# EAGLE design mainboard-raspi-2 (EAGLE 6.4)
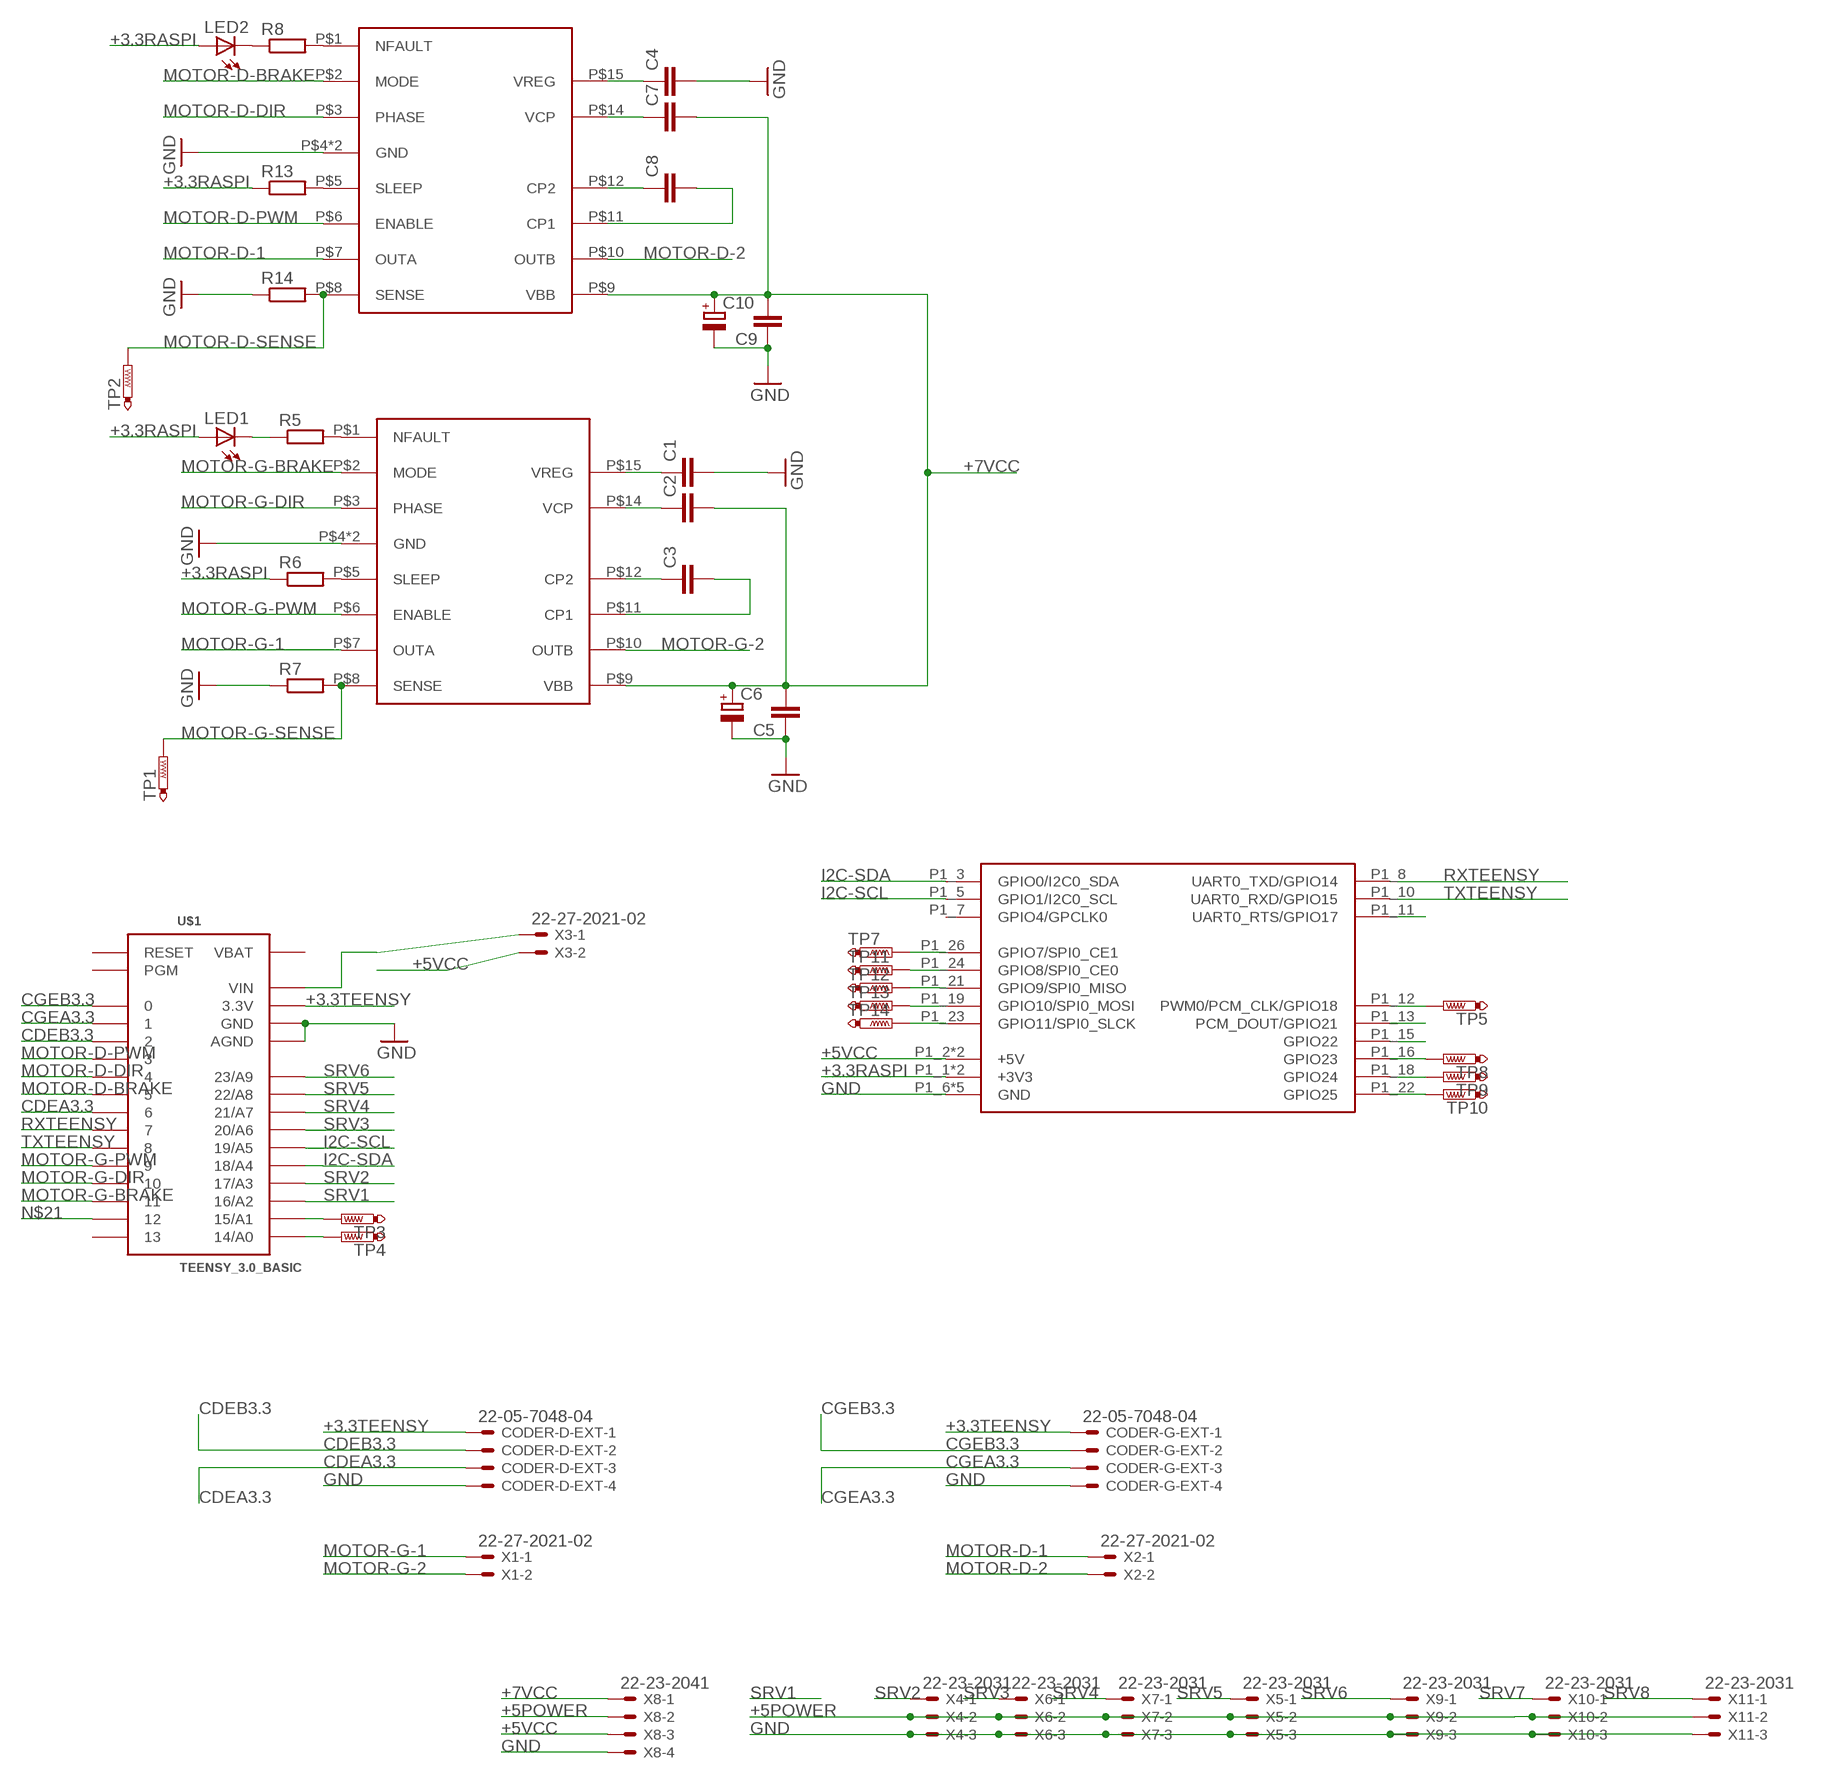
[diagram p0: schematic, sheet 1]

## Parts
C1  C-EUC0805K  [C0805K]
C2  C-EUC0805K  [C0805K]
C3  C-EUC0805K  [C0805K]
C4  C-EUC0805K  [C0805K]
C5  C-EUC0805K  [C0805K]
C6  CPOL-EUE3.5-8  [E3,5-8]
C7  C-EUC0805K  [C0805K]
C8  C-EUC0805K  [C0805K]
C9  C-EUC0805K  [C0805K]
C10  CPOL-EUE3.5-8  [E3,5-8]
CODER-D-EXT  22-05-7048-04  [7395-04]
CODER-G-EXT  22-05-7048-04  [7395-04]
LED1  LED3MM  [LED3MM]
LED2  LED3MM  [LED3MM]
R5  R-EU_R0805W  [R0805W]
R6  R-EU_0204/7  [0204/7]
R7  R-EU_R0805W  [R0805W]
R8  R-EU_R0805W  [R0805W]
R13  R-EU_0204/7  [0204/7]
R14  R-EU_R0805W  [R0805W]
TP1  PTR1PAD1-13  [P1-13]
TP2  PTR1PAD1-13  [P1-13]
TP3  PTR1PAD1-13  [P1-13]
TP4  PTR1PAD1-13  [P1-13]
TP5  PTR1PAD1-13  [P1-13]
TP7  PTR1PAD1-13  [P1-13]
TP8  PTR1PAD1-13  [P1-13]
TP9  PTR1PAD1-13  [P1-13]
TP10  PTR1PAD1-13  [P1-13]
TP11  PTR1PAD1-13  [P1-13]
TP12  PTR1PAD1-13  [P1-13]
TP13  PTR1PAD1-13  [P1-13]
TP14  PTR1PAD1-13  [P1-13]
U$1  TEENSY_3.0_BASIC  [TEENSY_3.0_BASIC]
U$3  A3950-DIL  [DIL16]
U$4  A3950-DIL  [DIL16]
U$5  RPI-B-V1SHIELD  [RPI-B-V1-SHIELD]
X1  22-27-2021-02  [6410-02]
X2  22-27-2021-02  [6410-02]
X3  22-27-2021-02  [6410-02]
X4  22-23-2031  [22-23-2031]
X5  22-23-2031  [22-23-2031]
X6  22-23-2031  [22-23-2031]
X7  22-23-2031  [22-23-2031]
X8  22-23-2041  [22-23-2041]
X9  22-23-2031  [22-23-2031]
X10  22-23-2031  [22-23-2031]
X11  22-23-2031  [22-23-2031]

## Nets
+3.3RASPI: LED1.A LED2.A R6.1 R13.1 U$5.P1_1(+3V3) U$5.P1_17(+3V3)
+3.3TEENSY: CODER-D-EXT.1 CODER-G-EXT.1 U$1.3.3V U$1.3.3V1(3.3V)
+5POWER: X4.2 X5.2 X6.2 X7.2 X8.2 X9.2 X10.2 X11.2
+5VCC: U$5.P1_2(+5V) U$5.P1_4(+5V) X3.2 X8.3
+7VCC: C2.2 C5.2 C6.+ C7.2 C9.2 C10.+ U$3.P$9(VBB) U$4.P$9(VBB) X8.1
CDEA3.3: CODER-D-EXT.3 U$1.6
CDEB3.3: CODER-D-EXT.2 U$1.2
CGEA3.3: CODER-G-EXT.3 U$1.1
CGEB3.3: CODER-G-EXT.2 U$1.0
GND: C1.2 C4.2 C5.1 C6.- C9.1 C10.- CODER-D-EXT.4 CODER-G-EXT.4 R7.1 R14.1 U$1.AGND U$1.GND U$1.GND1(GND) U$3.P$4(GND) U$3.P$13(GND) U$4.P$4(GND) U$4.P$13(GND) U$5.P1_6(GND) U$5.P1_9(GND) U$5.P1_14(GND) U$5.P1_20(GND) U$5.P1_25(GND) X4.3 X5.3 X6.3 X7.3 X8.4 X9.3 X10.3 X11.3
I2C-SCL: U$1.19/A5 U$5.P1_5(GPIO1/I2C0_SCL)
I2C-SDA: U$1.18/A4 U$5.P1_3(GPIO0/I2C0_SDA)
MOTOR-D-1: U$4.P$7(OUTA) X2.1
MOTOR-D-2: U$4.P$10(OUTB) X2.2
MOTOR-D-BRAKE: U$1.5 U$4.P$2(MODE)
MOTOR-D-DIR: U$1.4 U$4.P$3(PHASE)
MOTOR-D-PWM: U$1.3 U$4.P$6(ENABLE)
MOTOR-D-SENSE: R14.2 TP2.TP U$4.P$8(SENSE)
MOTOR-G-1: U$3.P$7(OUTA) X1.1
MOTOR-G-2: U$3.P$10(OUTB) X1.2
MOTOR-G-BRAKE: U$1.11 U$3.P$2(MODE)
MOTOR-G-DIR: U$1.10 U$3.P$3(PHASE)
MOTOR-G-PWM: U$1.9 U$3.P$6(ENABLE)
MOTOR-G-SENSE: R7.2 TP1.TP U$3.P$8(SENSE)
N$1: TP3.TP U$1.15/A1
N$2: U$5.P1_11(UART0_RTS/GPIO17)
N$3: U$1.VIN X3.1
N$4: TP4.TP U$1.14/A0
N$5: R5.2 U$3.P$1(NFAULT)
N$6: R6.2 U$3.P$5(SLEEP)
N$7: R8.2 U$4.P$1(NFAULT)
N$8: C1.1 U$3.P$15(VREG)
N$9: C2.1 U$3.P$14(VCP)
N$10: C3.1 U$3.P$12(CP2)
N$11: LED1.K(C) R5.1
N$12: R13.2 U$4.P$5(SLEEP)
N$13: C4.1 U$4.P$15(VREG)
N$14: C7.1 U$4.P$14(VCP)
N$15: C3.2 U$3.P$11(CP1)
N$16: C8.1 U$4.P$12(CP2)
N$17: TP5.TP U$5.P1_12(PWM0/PCM_CLK/GPIO18)
N$18: C8.2 U$4.P$11(CP1)
N$19: U$5.P1_13(PCM_DOUT/GPIO21)
N$20: LED2.K(C) R8.1
N$21: U$1.12
N$22: U$5.P1_15(GPIO22)
N$23: TP8.TP U$5.P1_16(GPIO23)
N$24: TP9.TP U$5.P1_18(GPIO24)
N$25: TP10.TP U$5.P1_22(GPIO25)
N$26: TP7.TP U$5.P1_26(GPIO7/SPI0_CE1)
N$27: TP11.TP U$5.P1_24(GPIO8/SPI0_CE0)
N$28: TP12.TP U$5.P1_21(GPIO9/SPI0_MISO)
N$29: TP13.TP U$5.P1_19(GPIO10/SPI0_MOSI)
N$30: TP14.TP U$5.P1_23(GPIO11/SPI0_SLCK)
RXTEENSY: U$1.7 U$5.P1_8(UART0_TXD/GPIO14)
SRV1: U$1.16/A2
SRV2: U$1.17/A3 X4.1
SRV3: U$1.20/A6 X6.1
SRV4: U$1.21/A7 X7.1
SRV5: U$1.22/A8 X5.1
SRV6: U$1.23/A9 X9.1
SRV7: X10.1
SRV8: X11.1
TXTEENSY: U$1.8 U$5.P1_10(UART0_RXD/GPIO15)
Unconnected: U$1.13 U$1.PGM U$1.RESET U$5.P1_7(GPIO4/GPCLK0)

## Power pins joined to a net without a drawn wire
VBAT: U$1.VBAT

## Library data of the parts
C1-C5 C7-C9 = rcl:C-EU: CAPACITOR, European symbol
C6 C10 = rcl:CPOL-EU: POLARIZED CAPACITOR, European symbol
CODER-D-EXT CODER-G-EXT = con-molex:22-?-04: CONNECTOR wire to board 2.54 mm (.1 inch) pitch header; OC_FARNELL: unknown; OC_NEWARK: unknown
LED1 LED2 = led:LED: LED OSRAM: - CHIPLED LG R971, LG N971, LY N971, LG Q971, LY Q971, LO R971, LY R971 LH N974, LH R974 LS Q976, LO Q976, LY Q976 LO Q996 - Hyper CHIPLED LW Q18S LB Q993, LB Q99A, LB R99A - SideLED LS A670, LO A670, LY A670, LG A670, LP A670 LB A673, LV A673, LT A673, LW A673 LH A674 LY A675 LS A676, LA A676, LO A676, LY A676, LW A676 LS A679, LY A679, LG A679 - Hyper Micro SIDELED® LS Y876, LA Y876, LO Y876, LY Y876 LT Y87S - SmartLED LW L88C, LW L88S LB L89C, LB L89S, LG L890 LS L89K, LO L89K, LY L89K LS L896, LA L896, LO L896, LY L896 - TOPLED LS T670, LO T670, LY T670, LG T670, LP T670 LSG T670, LSP T670, LSY T670, LOP T670, LYG T670 LG T671, LOG T671, LSG T671 LB T673, LV T673, LT T673, LW T673 LH T674 LS T676, LA T676, LO T676, LY T676, LB T676, LH T676, LSB T676, LW T676 LB T67C, LV T67C, LT T67C, LS T67K, LO T67K, LY T67K, LW E67C LS E67B, LA E67B, LO E67B, LY E67B, LB E67C, LV E67C, LT E67C LW T67C LS T679, LY T679, LG T679 LS T770, LO T770, LY T770, LG T770, LP T770 LB T773, LV T773, LT T773, LW T773 LH T774 LS E675, LA E675, LY E675, LS T675 LS T776, LA T776, LO T776, LY T776, LB T776 LHGB T686 LT T68C, LB T68C - Hyper Mini TOPLED® LB M676 - Mini TOPLED Santana® LG M470 LS M47K, LO M47K, LY M47K Source: http://www.osram.convergy.de LUXEON: - LUMILED® LXK2-PW12-R00, LXK2-PW12-S00, LXK2-PW14-U00, LXK2-PW14-V00 LXK2-PM12-R00, LXK2-PM12-S00, LXK2-PM14-U00 LXK2-PE12-Q00, LXK2-PE12-R00, LXK2-PE12-S00, LXK2-PE14-T00, LXK2-PE14-U00 LXK2-PB12-K00, LXK2-PB12-L00, LXK2-PB12-M00, LXK2-PB14-N00, LXK2-PB14-P00, LXK2-PB14-Q00 LXK2-PR12-L00, LXK2-PR12-M00, LXK2-PR14-Q00, LXK2-PR14-R00 LXK2-PD12-Q00, LXK2-PD12-R00, LXK2-PD12-S00 LXK2-PH12-R00, LXK2-PH12-S00 LXK2-PL12-P00, LXK2-PL12-Q00, LXK2-PL12-R00 Source: www.luxeon.com KINGBRIGHT: KA-3528ASYC Source: www.kingbright.com
R5-R8 R13 R14 = rcl:R-EU_: RESISTOR, European symbol
TP1-TP5 TP7-TP14 = testpad:PTR1: TEST PIN
U$1 = Teensy3.0:TEENSY_3.0_BASIC: Basic Teensy 3.0 with none of the 'inner' pins enabled. See '+4', 'AllAnalogPins", and 'AllPins' packages for additional pin holes, as needed.
U$3 U$4 = A3950:A3950-DIL
U$5 = raspberry:RPI-B-V1: First revision of the Model B board without P5 and P6 headers and mounting holes. Choose the "SHIELD" variant for a predefined Dimension layer.
X1-X3 = con-molex:22-?-02: CONNECTOR wire to board 2.54 mm (.1 inch) pitch header; OC_FARNELL: unknown; OC_NEWARK: unknown
X4-X7 X9-X11 = con-molex:22-23-2031: .100" (2.54mm) Center Header - 3 Pin; MF: MOLEX; MPN: 22-23-2031; OC_FARNELL: 1462950; OC_NEWARK: 30C0862
X8 = con-molex:22-23-2041: .100" (2.54mm) Center Header - 4 Pin; MF: MOLEX; MPN: 22-23-2041; OC_FARNELL: 1462920; OC_NEWARK: 38C0355

## Board
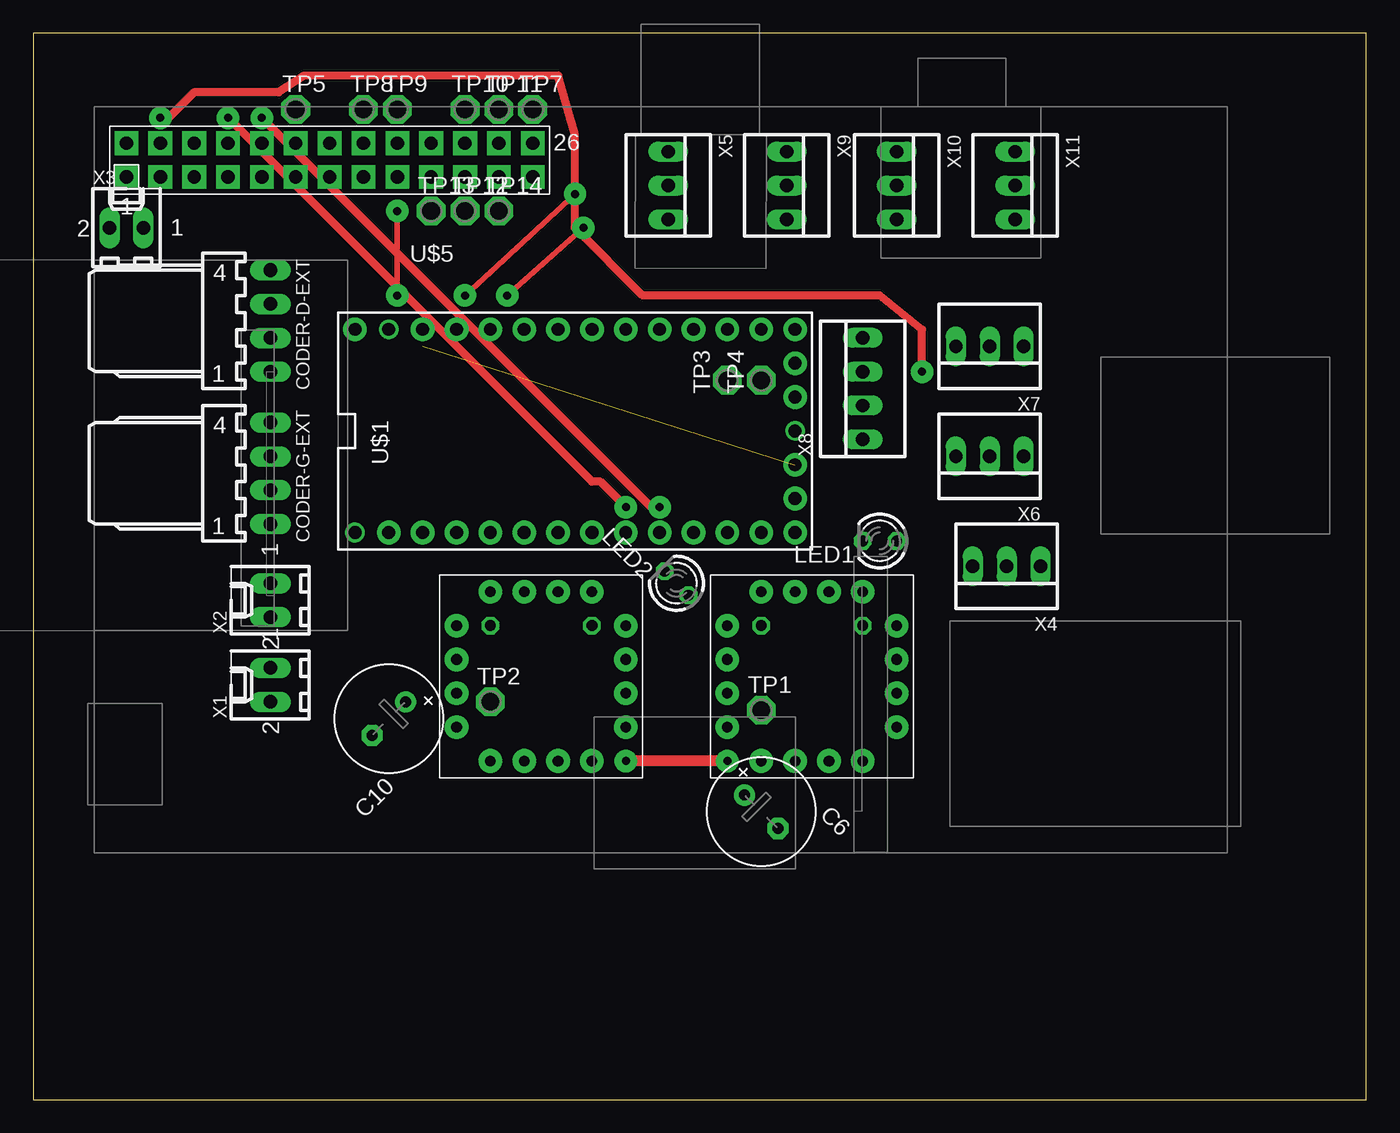
[diagram p1: board, top side]
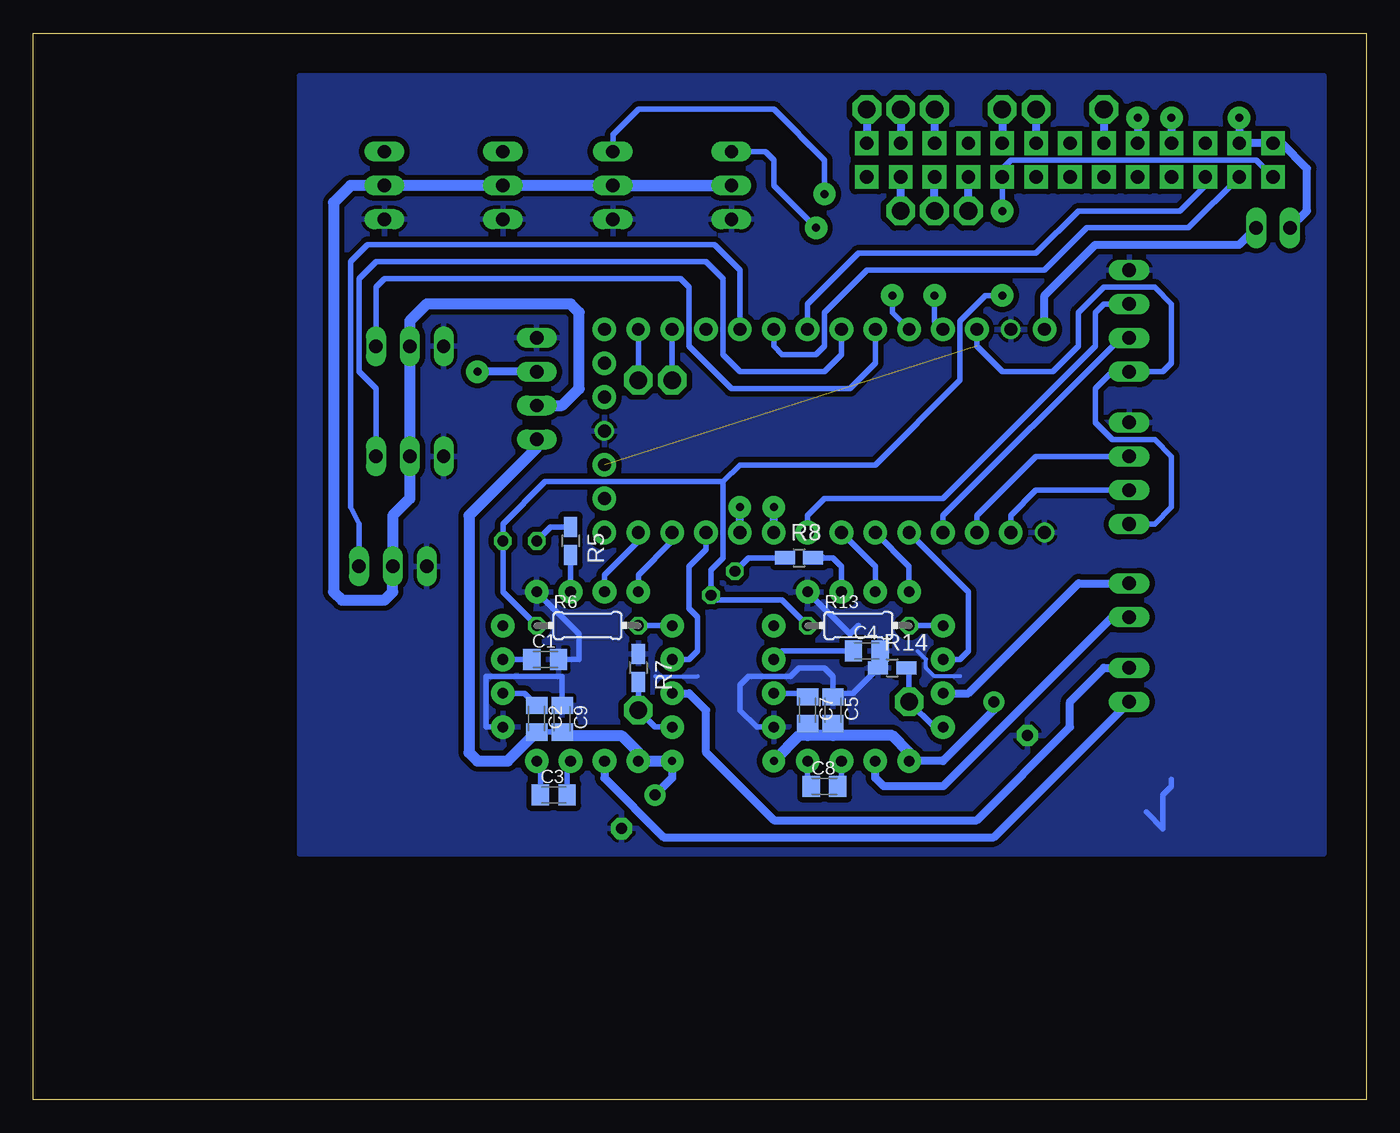
[diagram p2: board, bottom side, seen from below]

Size 100 x 80 mm. Coordinates in mm from the lower left corner, seen from the top.
Outline: 0,0 100,0 100,80 0,80 0,0
Copper layers (1*16): Top 0.035mm / dielectric 1.5mm / Bottom 0.035mm
Design rules "default": minimum track width 10mil, minimum drill 24mil, track to track 8mil, track to pad 8mil, pad to pad 8mil, via to via 8mil, smd to smd 8mil, copper to edge 40mil, drill to drill 8mil, minimum pad ring 10mil, minimum via ring 8mil, stop-mask expansion 4mil, vias tented up to drill 0mil, thermal gap 10mil

### Footprints (pad centres in the part's own frame; a part is rotated, then mirrored left to right if it is on the bottom)
C0805K = smd 1.3 x 1.6: 1 -1,0; 2 1,0
E3,5-8 = drill 0.813 pad 1.6: + -1.778,0 | drill 0.813 pad 1.6 octagon: - 1.778,0
7395-04 = drill 1.016 long: 1 3.81,0; 2 1.27,0; 3 -1.27,0; 4 -3.81,0
LED3MM = drill 0.813 octagon: A -1.27,0; K 1.27,0
R0805W = smd 1.5 x 1: 1 -1.052,0; 2 1.052,0
0204/7 = drill 0.813 octagon: 1 -3.81,0; 2 3.81,0
P1-13 = drill 1.321 pad 2.159 octagon: TP 0,0
TEENSY_3.0_BASIC = drill 0.965: 0 -7.62,13.97; 1 -7.62,11.43; 2 -7.62,8.89; 3 -7.62,6.35; 3.3V 7.62,11.43; 3.3V1 -2.54,-16.51; 4 -7.62,3.81; 5 -7.62,1.27; 6 -7.62,-1.27; 7 -7.62,-3.81; 8 -7.62,-6.35; 9 -7.62,-8.89; 10 -7.62,-11.43; 11 -7.62,-13.97; 12 -7.62,-16.51; 13 7.62,-16.51; 14/A0 7.62,-13.97; 15/A1 7.62,-11.43; 16/A2 7.62,-8.89; 17/A3 7.62,-6.35; 18/A4 7.62,-3.81; 19/A5 7.62,-1.27; 20/A6 7.62,1.27; 21/A7 7.62,3.81; 22/A8 7.62,6.35; 23/A9 7.62,8.89; AGND 7.62,13.97; GND -7.62,16.51; GND1 0,-16.51; PGM 2.54,-16.51; RESET 5.08,-16.51; VBAT -5.08,-16.51; VIN 7.62,16.51
DIL16 = drill 0.8 pad 1.778: P$1 -1.27,-6.35; P$2 1.27,-6.35; P$3 3.81,-6.35; P$4 -3.81,-6.35; P$5 6.35,-3.81; P$6 6.35,-1.27; P$7 6.35,1.27; P$8 6.35,3.81; P$9 3.81,6.35; P$10 1.27,6.35; P$11 -1.27,6.35; P$12 -3.81,6.35; P$13 -6.35,3.81; P$14 -6.35,1.27; P$15 -6.35,-1.27; P$16 -6.35,-3.81
RPI-B-V1-SHIELD = drill 1 square: P1_1 0,0 | drill 1 pad 1.676: P1_2 0,2.54; P1_6 5.08,2.54 | drill 1: P1_3 2.54,0; P1_4 2.54,2.54; P1_5 5.08,0; P1_7 7.62,0; P1_8 7.62,2.54; P1_9 10.16,0; P1_10 10.16,2.54; P1_11 12.7,0; P1_12 12.7,2.54; P1_13 15.24,0; P1_14 15.24,2.54; P1_15 17.78,0; P1_16 17.78,2.54; P1_17 20.32,0; P1_18 20.32,2.54; P1_19 22.86,0; P1_20 22.86,2.54; P1_21 25.4,0; P1_22 25.4,2.54; P1_23 27.94,0; P1_24 27.94,2.54; P1_25 30.48,0; P1_26 30.48,2.54
6410-02 = drill 1.016 long: 1 1.27,0; 2 -1.27,0
22-23-2031 = drill 1 long: 1 -2.54,0; 2 0,0; 3 2.54,0
22-23-2041 = drill 1 long: 1 -3.81,0; 2 -1.27,0; 3 1.27,0; 4 3.81,0

### Placement (x,y rotation side)
C1  61.59,33.02 0 bottom
C2  62.23,28.57 270 bottom
C3  60.96,22.86 0 bottom
C4  37.47,33.66 0 bottom
C5  40.01,29.21 270 bottom
C6  54.61,21.59 315 top
C7  41.91,29.21 270 bottom
C8  40.64,23.5 0 bottom
C9  60.33,28.57 270 bottom
C10  26.67,28.57 225 top
CODER-D-EXT  17.78,58.42 270 top
CODER-G-EXT  17.78,46.99 270 top
LED1  63.5,41.91 180 top
LED2  48.26,38.73 135 top
R5  59.69,41.91 270 bottom
R6  58.42,35.56 0 bottom
R7  54.61,32.38 270 bottom
R8  42.55,40.64 0 bottom
R13  38.1,35.56 0 bottom
R14  35.56,32.38 0 bottom
TP1  54.61,29.21 0 top
TP2  34.29,29.84 0 top
TP3  52.07,53.98 90 top
TP4  54.61,53.98 90 top
TP5  19.68,74.3 0 top
TP7  37.47,74.3 0 top
TP8  24.77,74.3 0 top
TP9  27.3,74.3 0 top
TP10  32.38,74.3 0 top
TP11  34.92,74.3 0 top
TP12  32.38,66.67 0 top
TP13  29.84,66.67 0 top
TP14  34.92,66.67 0 top
U$1  40.64,50.16 90 top
U$3  58.42,31.75 180 top
U$4  38.1,31.75 180 top
U$5  6.99,69.22 0 top
X1  17.78,31.11 90 top
X2  17.78,37.47 90 top
X3  6.99,65.41 0 top
X4  73.03,40.01 180 top
X5  47.62,68.58 270 top
X6  71.75,48.26 180 top
X7  71.75,56.52 180 top
X8  62.23,53.34 90 top
X9  56.52,68.58 270 top
X10  64.77,68.58 270 top
X11  73.66,68.58 270 top

### Tracks (layer width: path | path; a pad name or v marks a point on that pad's centre or on a via)
+3.3RASPI  (via drill 0.6 pad 1.68)
  Top 0.406: v27.3,66.67 v27.3,60.33
  Bottom 0.406: R6.1 64.77,38.1 LED1.A 64.77,43.18 61.59,46.35 48.26,46.35 | v27.3,66.67 U$5.P1_17 27.3,69.85 26.67,70.48 8.26,70.48 U$5.P1_1 | R13.1 43.81,37.47 48.79,37.47 LED2.A 49.16,39.74 48.26,40.64 48.26,46.35 | v27.3,60.33 28.57,60.33 30.48,58.42 30.48,53.98 36.83,47.62 46.99,47.62 48.26,46.35
+3.3TEENSY  (1 unrouted)
  Bottom 0.406: CODER-G-EXT.1 15.88,43.18 14.61,44.45 14.61,48.26 15.88,49.53 19.05,49.53 20.32,50.8 20.32,53.34 19.05,54.61 CODER-D-EXT.1 15.24,54.61 14.61,55.24 14.61,59.69 15.88,60.96 19.68,60.96 21.59,59.05 21.59,56.52 23.5,54.61 27.3,54.61 29.21,56.52 U$1.3.3V
+5POWER
  Bottom 0.813: X9.2 X5.2 X10.2 X11.2 76.2,68.58 77.47,67.31 77.47,38.1 76.83,37.47 73.66,37.47 73.03,38.1 X4.2 73.03,43.81 71.75,45.09 X6.2 X7.2 71.75,58.42 70.48,59.69 59.69,59.69 59.05,59.05 59.05,53.34 60.33,52.07 X8.2
+5VCC  (via drill 0.6 pad 1.68)
  Top 0.61: v66.67,54.61 66.67,57.78 63.5,60.33 45.72,60.33 40.64,65.41 40.64,72.39 39.37,76.83 20.32,76.83 18.41,75.56 12.06,75.56 10.16,73.66 v9.53,73.66
  Bottom 0.61: X8.3 v66.67,54.61 | v9.53,73.66 U$5.P1_4 U$5.P1_2 6.35,71.75 4.45,69.85 4.45,66.67 X3.2
+7VCC  (via drill 0.6 pad 1.68)
  Top 0.813: v52.07,25.4 v44.45,25.4
  Bottom 0.406: 60.05,27.3 C9.2 C2.2 | C7.2 41.91,27.3 | C5.2 40.01,27.3
  Bottom 0.61: C10.+ 27.93,29.22 31.75,25.4 U$4.P$9 | v52.07,25.4 52.07,24.13 C6.+
  Bottom 0.813: 60.05,27.3 55.88,27.3 54.61,26.04 U$3.P$9 v52.07,25.4 | C2.2 64.41,25.4 66.67,25.4 67.31,26.04 67.31,43.81 62.23,48.9 X8.1 | U$4.P$9 34.29,26.04 35.56,27.3 40.01,27.3 41.91,27.3 42.55,27.3 v44.45,25.4
CDEA3.3
  Bottom 0.406: U$1.6 41.91,43.81 40.64,45.09 31.75,45.09 20.32,56.52 20.32,59.05 19.68,59.69 CODER-D-EXT.3
CDEB3.3
  Bottom 0.406: CODER-D-EXT.2 18.41,57.15 31.75,43.81 U$1.2
CGEA3.3
  Bottom 0.406: CODER-G-EXT.3 24.77,48.26 29.21,43.81 U$1.1
CGEB3.3
  Bottom 0.406: CODER-G-EXT.2 24.77,45.72 26.67,43.81 U$1.0
GND
  Bottom 0.305: 30.48,31.75 32.38,31.75 33.02,32.38 33.02,33.02 33.66,33.66 | 53.34,31.75 50.16,31.75
  Bottom 0.406: U$3.P$4 59.05,34.92 59.05,33.02 C1.2 | U$4.P$4 38.73,34.92 38.1,35.56 | C9.1 60.33,31.75 66.04,31.75 66.04,27.94 U$3.P$13 | 16.51,21.59 15.24,20.32 15.24,22.86 14.61,23.5 14.61,24 | C4.2 36.47,32.53 R14.1 38.52,30.48 40.01,30.48 C5.1 40.01,31.75 40.64,32.38 42.55,32.38 43.18,31.75 46.35,31.75 46.99,31.11 46.99,29.21 45.72,27.94 U$4.P$13
  pour Bottom (isolate 0.406): 3.17,76.83 3.17,18.41 80.01,18.41 80.01,76.83
I2C-SCL
  Bottom 0.406: U$5.P1_5 12.06,68.58 13.97,66.67 21.59,66.67 24.77,63.5 38.1,63.5 41.91,59.69 U$1.19/A5
I2C-SDA
  Bottom 0.406: U$5.P1_3 13.34,65.41 20.95,65.41 24.13,62.23 37.47,62.23 40.64,59.05 40.64,56.52 41.27,55.88 43.81,55.88 44.45,56.52 U$1.18/A4
MOTOR-D-1
  Bottom 0.61: U$4.P$7 29.84,30.48 21.59,38.73 X2.1
MOTOR-D-2
  Bottom 0.61: X2.2 19.05,36.2 31.75,23.5 36.2,23.5 36.83,24.13 U$4.P$10
MOTOR-D-BRAKE
  Bottom 0.406: U$1.5 36.83,40.01 U$4.P$2
MOTOR-D-DIR
  Bottom 0.406: U$1.4 34.29,40.01 U$4.P$3
MOTOR-D-PWM
  Bottom 0.406: U$4.P$6 30.48,33.02 29.84,33.66 29.84,38.1 U$1.3
MOTOR-D-SENSE
  Bottom 0.406: U$4.P$8 32.38,27.94 TP2.TP 34.29,32.17 R14.2
MOTOR-G-1
  Bottom 0.61: U$3.P$7 50.8,30.48 49.53,29.21 49.53,26.04 44.45,20.95 29.21,20.95 22.23,27.94 22.23,29.84 19.68,32.38 X1.1
MOTOR-G-2
  Bottom 0.61: U$3.P$10 57.15,24.13 52.7,19.68 27.94,19.68 X1.2
MOTOR-G-BRAKE
  Bottom 0.406: U$1.11 54.61,41.91 57.15,39.37 U$3.P$2
MOTOR-G-DIR
  Bottom 0.406: U$1.10 52.07,41.91 54.61,39.37 U$3.P$3
MOTOR-G-PWM
  Bottom 0.406: U$3.P$6 50.8,33.02 50.16,33.66 50.16,36.2 50.8,36.83 50.8,40.01 49.53,41.27 U$1.9
MOTOR-G-SENSE
  Bottom 0.406: U$3.P$8 53.34,27.94 TP1.TP R7.2
N$1
  Bottom 0.406: TP3.TP U$1.15/A1
N$3
  Bottom 0.61: U$1.VIN 24.13,60.33 20.32,64.14 9.53,64.14 X3.1
N$4
  Bottom 0.406: TP4.TP U$1.14/A0
N$5
  Bottom 0.406: R5.2 U$3.P$1
N$6
  Bottom 0.406: U$3.P$5 R6.2
N$7
  Bottom 0.406: 39.37,38.73 U$4.P$1 39.37,40.01 40.01,40.64 40.86,40.64
  Bottom 0.61: 40.86,40.64 R8.2
N$8
  Bottom 0.406: U$3.P$15 C1.1
N$9
  Bottom 0.406: U$3.P$14 63.13,30.48 C2.1
N$10
  Bottom 0.406: C3.1 61.96,25.04 U$3.P$12
N$11
  Bottom 0.406: R5.1 61.18,42.96 LED1.K
N$12
  Bottom 0.406: U$4.P$5 R13.2
N$13
  Bottom 0.406: C4.1 43.81,33.66 U$4.P$15
N$14
  Bottom 0.406: U$4.P$14 42.18,30.48 C7.1
N$15
  Bottom 0.406: C3.2 59.96,25.04 U$3.P$11
N$16
  Bottom 0.406: U$4.P$12 41.91,23.77 C8.1
N$17
  Bottom 0.61: TP5.TP U$5.P1_12
N$18
  Bottom 0.406: U$4.P$11 39.37,23.77 C8.2
N$20
  Bottom 0.406: R8.1 46.35,40.64 LED2.K
N$23
  Bottom 0.61: TP8.TP U$5.P1_16
N$24
  Bottom 0.61: TP9.TP U$5.P1_18
N$25
  Bottom 0.61: TP10.TP U$5.P1_22
N$26
  Bottom 0.61: TP7.TP U$5.P1_26
N$27
  Bottom 0.61: TP11.TP U$5.P1_24
N$28
  Bottom 0.61: TP12.TP U$5.P1_21
N$29
  Bottom 0.61: TP13.TP U$5.P1_19
N$30
  Bottom 0.61: TP14.TP U$5.P1_23
N$31  (via drill 0.6 pad 1.78)
  other vias: 29.21,57.79
N$32  (via drill 0.6 pad 1.78)
  other vias: 24.13,57.79
N$33  (via drill 0.6 pad 1.78)
  other vias: 31.75,57.79
N$34  (via drill 0.6 pad 1.78)
  other vias: 34.29,57.79
N$35  (via drill 0.6 pad 1.78)
  other vias: 36.83,57.79
N$36  (via drill 0.6 pad 1.78)
  other vias: 39.37,57.79
N$37  (via drill 0.6 pad 1.78)
  other vias: 41.91,57.79
N$38  (via drill 0.6 pad 1.78)
  other vias: 44.45,57.79
N$39  (via drill 0.6 pad 1.78)
  other vias: 46.99,57.79
N$40  (via drill 0.6 pad 1.78)
  other vias: 49.53,57.79
N$41  (via drill 0.6 pad 1.78)
  other vias: 52.07,57.79
N$42  (via drill 0.6 pad 1.78)
  other vias: 54.61,57.79
N$43  (via drill 0.6 pad 1.78)
  other vias: 57.15,57.79
N$44  (via drill 0.6 pad 1.78)
  other vias: 57.15,55.25
N$45  (via drill 0.6 pad 1.78)
  other vias: 57.15,52.71
N$46  (via drill 0.6 pad 1.78)
  other vias: 57.15,47.63
N$47  (via drill 0.6 pad 1.78)
  other vias: 57.15,45.09
N$48  (via drill 0.6 pad 1.78)
  other vias: 57.15,42.55
N$49  (via drill 0.6 pad 1.78)
  other vias: 54.61,42.55
N$50  (via drill 0.6 pad 1.78)
  other vias: 52.07,42.55
N$51  (via drill 0.6 pad 1.78)
  other vias: 49.53,42.55
N$52  (via drill 0.6 pad 1.78)
  other vias: 46.99,42.55
N$53  (via drill 0.6 pad 1.78)
  other vias: 44.45,42.55
N$54  (via drill 0.6 pad 1.78)
  other vias: 41.91,42.55
N$55  (via drill 0.6 pad 1.78)
  other vias: 39.37,42.55
N$56  (via drill 0.6 pad 1.78)
  other vias: 36.83,42.55
N$57  (via drill 0.6 pad 1.78)
  other vias: 34.29,42.55
N$58  (via drill 0.6 pad 1.78)
  other vias: 31.75,42.55
N$59  (via drill 0.6 pad 1.78)
  other vias: 29.21,42.55
N$60  (via drill 0.6 pad 1.78)
  other vias: 26.67,42.55
N$61  (via drill 0.6 pad 1.78)
  other vias: 6.99,71.76
N$62  (via drill 0.6 pad 1.78)
  other vias: 9.53,71.76
N$63  (via drill 0.6 pad 1.78)
  other vias: 12.07,71.76
N$64  (via drill 0.6 pad 1.78)
  other vias: 14.61,71.76
N$65  (via drill 0.6 pad 1.78)
  other vias: 17.15,71.76
N$66  (via drill 0.6 pad 1.78)
  other vias: 19.69,71.76
N$67  (via drill 0.6 pad 1.78)
  other vias: 22.23,71.76
N$68  (via drill 0.6 pad 1.78)
  other vias: 24.77,71.76
N$69  (via drill 0.6 pad 1.78)
  other vias: 27.31,71.76
N$70  (via drill 0.6 pad 1.78)
  other vias: 29.85,71.76
N$71  (via drill 0.6 pad 1.78)
  other vias: 32.39,71.76
N$72  (via drill 0.6 pad 1.78)
  other vias: 34.93,71.76
N$73  (via drill 0.6 pad 1.78)
  other vias: 37.47,71.76
N$74  (via drill 0.6 pad 1.78)
  other vias: 37.47,69.22
N$75  (via drill 0.6 pad 1.78)
  other vias: 34.93,69.22
N$76  (via drill 0.6 pad 1.78)
  other vias: 32.39,69.22
N$77  (via drill 0.6 pad 1.78)
  other vias: 29.85,69.22
N$78  (via drill 0.6 pad 1.78)
  other vias: 27.31,69.22
N$79  (via drill 0.6 pad 1.78)
  other vias: 24.77,69.22
N$80  (via drill 0.6 pad 1.78)
  other vias: 22.23,69.22
N$81  (via drill 0.6 pad 1.78)
  other vias: 19.69,69.22
N$82  (via drill 0.6 pad 1.78)
  other vias: 17.15,69.22
N$83  (via drill 0.6 pad 1.78)
  other vias: 14.61,69.22
N$84  (via drill 0.6 pad 1.78)
  other vias: 12.07,69.22
N$85  (via drill 0.6 pad 1.78)
  other vias: 9.53,69.22
N$86  (via drill 0.6 pad 1.78)
  other vias: 6.99,69.22
RXTEENSY  (via drill 0.6 pad 1.68)
  Top 0.61: v44.45,44.45 42.55,46.35 41.91,46.35 v14.61,73.66
  Bottom 0.61: U$1.7 v44.45,44.45 | v14.61,73.66 U$5.P1_8
SRV2
  Bottom 0.406: U$1.17/A3 46.99,62.23 48.9,64.14 74.93,64.14 76.2,62.87 76.2,44.45 75.56,43.18 X4.1
SRV3
  Bottom 0.406: U$1.20/A6 39.37,55.88 40.64,54.61 46.99,54.61 48.26,55.88 48.26,61.59 49.53,62.87 74.3,62.87 75.56,61.59 75.56,54.61 74.3,53.34 X6.1
SRV4
  Bottom 0.406: X7.1 74.3,60.96 73.66,61.59 51.44,61.59 50.8,60.96 50.8,56.52 47.62,53.34 38.73,53.34 36.83,55.24 U$1.21/A7
SRV5  (via drill 0.6 pad 1.68)
  Top 0.406: v35.56,60.33 v41.27,65.41
  Bottom 0.406: U$1.22/A8 35.56,59.05 v35.56,60.33 | v41.27,65.41 44.45,68.58 44.45,70.48 45.09,71.12 X5.1
SRV6  (via drill 0.6 pad 1.68)
  Top 0.406: v32.38,60.33 v40.64,67.94
  Bottom 0.406: U$1.23/A9 32.38,58.42 v32.38,60.33 | v40.64,67.94 40.64,70.48 44.45,74.3 54.61,74.3 56.52,72.39 X9.1
TXTEENSY  (via drill 0.6 pad 1.68)
  Top 0.61: v46.99,44.45 46.35,44.45 v17.14,73.66
  Bottom 0.61: U$1.8 v46.99,44.45 | v17.14,73.66 U$5.P1_10